# Altium project PCB5.2.0.PrjPcb
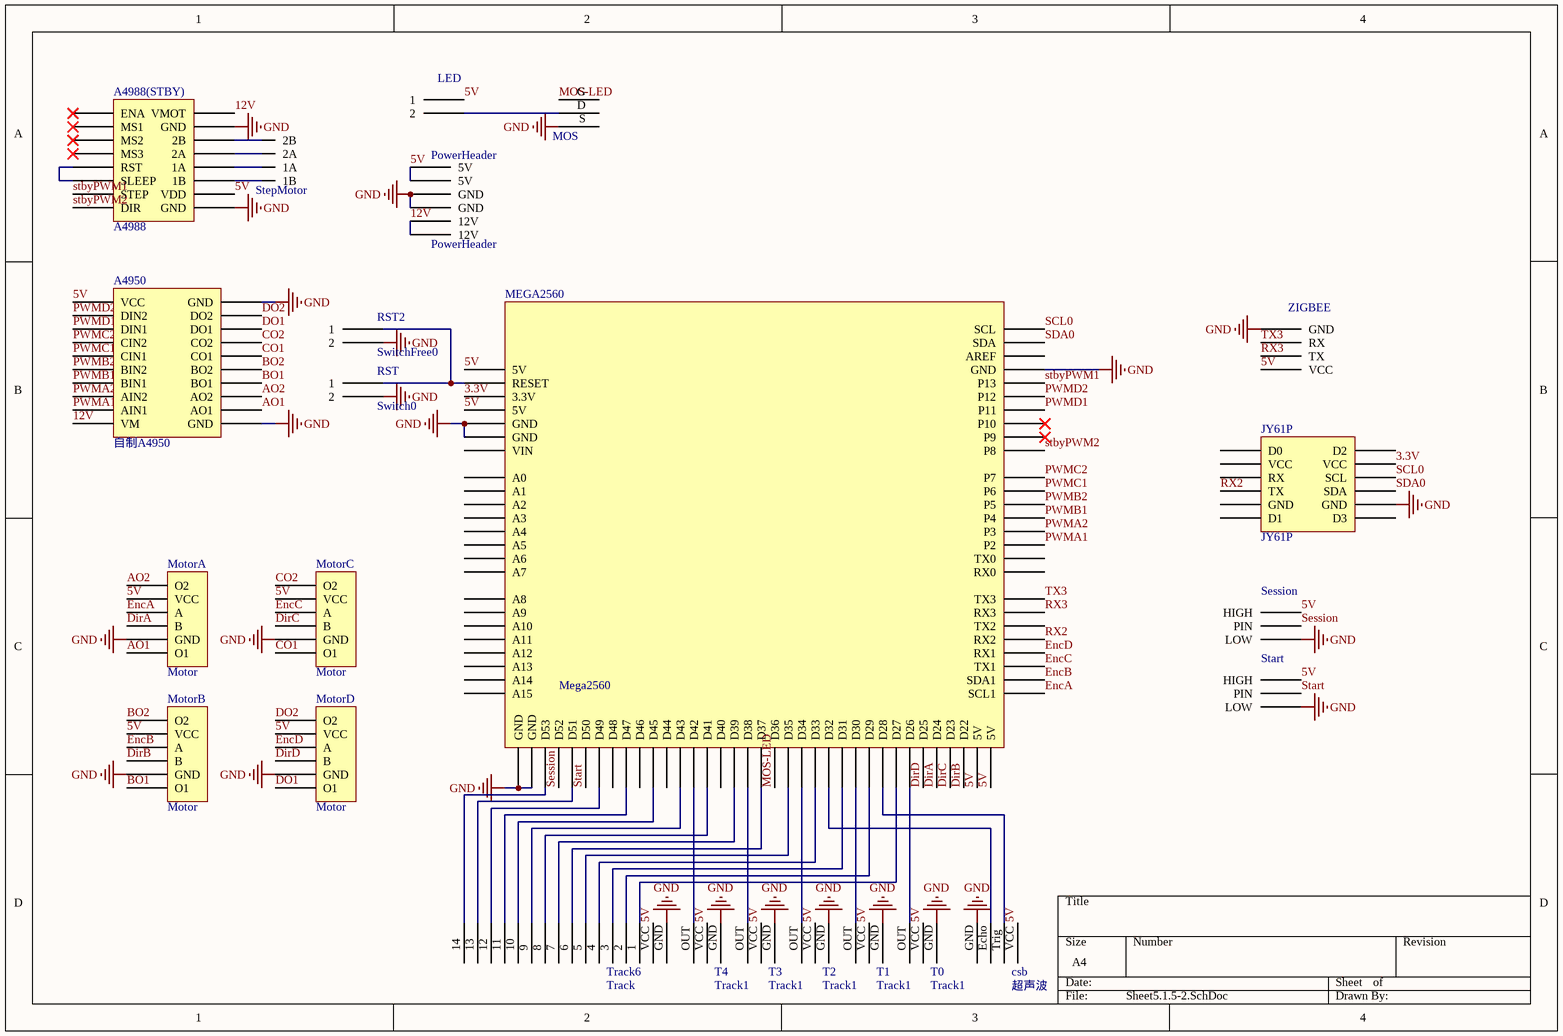
[diagram p0: Sheet5.1.5-2.SchDoc]
1 sheet, 24 parts. Net scope: global (net labels, ports and power ports of the same name join across sheets).
Board file: PCB5.2.3.PcbDoc

## Sheet Sheet5.1.5-2.SchDoc
size A4

### Parts
A4950  自制A4950  [自制A4950]
A4988(STBY)  A4988  [A4988]
csb  超声波  [超声波]
JY61P  JY61P  [JY61P]
LED  SwitchFree0  [SwitchFree]  (value not drawn)
MEGA2560  Mega2560  [MEGA2560]
MOS  MOS  [MOS]  (value not drawn)
MotorA  Motor  [Motor]
MotorB  Motor  [Motor]
MotorC  Motor  [Motor]
MotorD  Motor  [Motor]
PowerHeader  PowerHeader  [PowerHeader]
RST  Switch0  [Switch0]
RST2  SwitchFree0  [SwitchFree]
Session  Switch3  [Switch3]  (value not drawn)
Start  Switch3  [Switch3]  (value not drawn)
Step  StepMotor  [StepMotor]
T0  Track1  [TRACK1]
T1  Track1  [TRACK1]
T2  Track1  [TRACK1]
T3  Track1  [TRACK1]
T4  Track1  [TRACK1]
Track6  Track  [Track]
ZIGBEE  ZIGBEE  [ZIGBEE]  (value not drawn)

### Nets
GND: A4950.GND A4988(STBY).GND csb.GND JY61P.GND MEGA2560.GND MOS.S MotorA.GND MotorB.GND MotorC.GND MotorD.GND PowerHeader.GND RST.2 RST2.2 Session.LOW Start.LOW T0.GND T1.GND T2.GND T3.GND T4.GND Track6.GND ZIGBEE.GND
3.3V: JY61P.VCC MEGA2560.3.3V
5V: A4950.VCC A4988(STBY).VDD csb.VCC LED.1 MEGA2560.5V MotorA.VCC MotorB.VCC MotorC.VCC MotorD.VCC PowerHeader.5V Session.HIGH Start.HIGH T0.VCC T1.VCC T2.VCC T3.VCC T4.VCC Track6.VCC ZIGBEE.VCC
12V: A4950.VM A4988(STBY).VMOT PowerHeader.12V
AO1: A4950.AO1 MotorA.O1
AO2: A4950.AO2 MotorA.O2
BO1: A4950.BO1 MotorB.O1
BO2: A4950.BO2 MotorB.O2
CO1: A4950.CO1 MotorC.O1
CO2: A4950.CO2 MotorC.O2
DirA: MEGA2560.D24 MotorA.B
DirB: MEGA2560.D22 MotorB.B
DirC: MEGA2560.D23 MotorC.B
DirD: MEGA2560.D25 MotorD.B
DO1: A4950.DO1 MotorD.O1
DO2: A4950.DO2 MotorD.O2
EncA: MEGA2560.SCL1 MotorA.A
EncB: MEGA2560.SDA1 MotorB.A
EncC: MEGA2560.TX1 MotorC.A
EncD: MEGA2560.RX1 MotorD.A
MOS-LED: MEGA2560.D36 MOS.G
PWMA1: A4950.AIN1 MEGA2560.P2
PWMA2: A4950.AIN2 MEGA2560.P3
PWMB1: A4950.BIN1 MEGA2560.P4
PWMB2: A4950.BIN2 MEGA2560.P5
PWMC1: A4950.CIN1 MEGA2560.P6
PWMC2: A4950.CIN2 MEGA2560.P7
PWMD1: A4950.DIN1 MEGA2560.P11
PWMD2: A4950.DIN2 MEGA2560.P12
RX2: JY61P.TX MEGA2560.RX2
RX3: MEGA2560.RX3 ZIGBEE.TX
SCL0: JY61P.SCL MEGA2560.SCL
SDA0: JY61P.SDA MEGA2560.SDA
Session: MEGA2560.D52 Session.PIN
Start: MEGA2560.D50 Start.PIN
stbyPWM1: A4988(STBY).STEP MEGA2560.P13
stbyPWM2: A4988(STBY).DIR MEGA2560.P8
TX3: MEGA2560.TX3 ZIGBEE.RX
NetA4988(STBY)_1A: A4988(STBY).1A Step.1A
NetA4988(STBY)_1B: A4988(STBY).1B Step.1B
NetA4988(STBY)_2A: A4988(STBY).2A Step.2A
NetA4988(STBY)_2B: A4988(STBY).2B Step.2B
NetA4988(STBY)_RST: A4988(STBY).RST A4988(STBY).SLEEP
Netcsb_Echo: csb.Echo MEGA2560.D32
Netcsb_Trig: csb.Trig MEGA2560.D28
NetLED_2: LED.2 MOS.D
NetMEGA2560_D26: MEGA2560.D26 T0.OUT
NetMEGA2560_D27: MEGA2560.D27 Track6.1
NetMEGA2560_D29: MEGA2560.D29 Track6.2
NetMEGA2560_D30: MEGA2560.D30 T1.OUT
NetMEGA2560_D31: MEGA2560.D31 Track6.3
NetMEGA2560_D33: MEGA2560.D33 Track6.4
NetMEGA2560_D34: MEGA2560.D34 T2.OUT
NetMEGA2560_D35: MEGA2560.D35 Track6.5
NetMEGA2560_D37: MEGA2560.D37 Track6.6
NetMEGA2560_D38: MEGA2560.D38 T3.OUT
NetMEGA2560_D39: MEGA2560.D39 Track6.7
NetMEGA2560_D41: MEGA2560.D41 Track6.8
NetMEGA2560_D42: MEGA2560.D42 T4.OUT
NetMEGA2560_D43: MEGA2560.D43 Track6.9
NetMEGA2560_D45: MEGA2560.D45 Track6.10
NetMEGA2560_D47: MEGA2560.D47 Track6.11
NetMEGA2560_D49: MEGA2560.D49 Track6.12
NetMEGA2560_D51: MEGA2560.D51 Track6.13
NetMEGA2560_D53: MEGA2560.D53 Track6.14
NetMEGA2560_RESET: MEGA2560.RESET RST.1 RST2.1

Not connected (* = marked no-connect by the designer): A4988(STBY) ENA* MS1* MS2* MS3*; JY61P D0 D1 D2 D3 RX; MEGA2560 A0 A1 A2 A3 A4 A5 A6 A7 A8 A9 A10 A11 A12 A13 A14 A15 AREF D40 D44 D46 D48 P9* P10* RX0 TX0 TX2 VIN